# EAGLE schematic jardim (EAGLE 7.6.0)
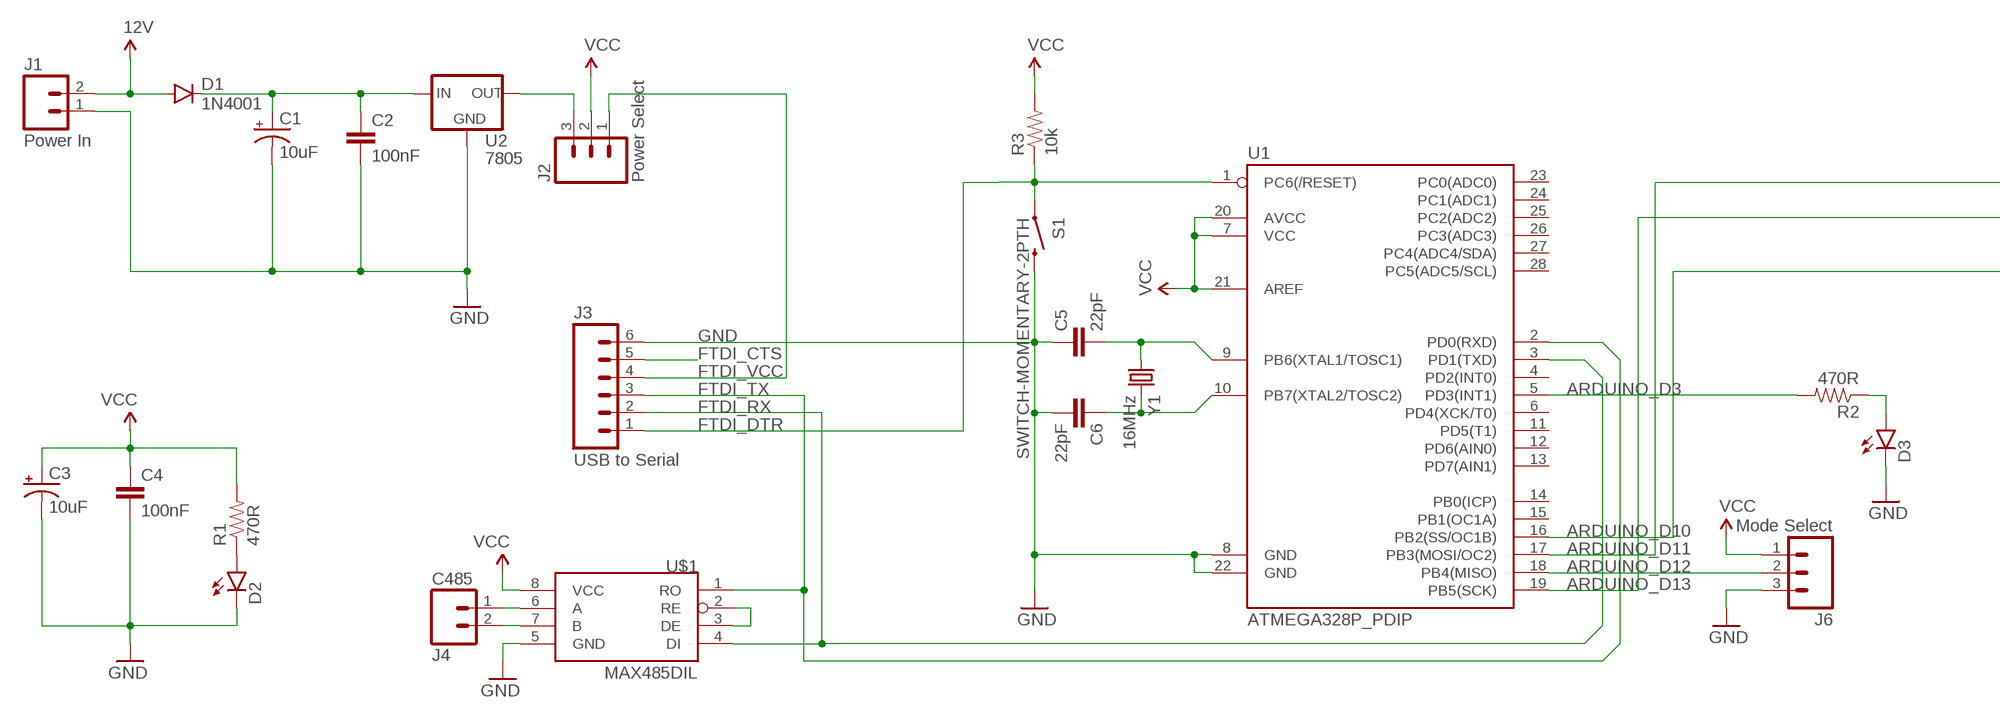
[diagram p0: schematic, sheet 1, part 1 of 2]
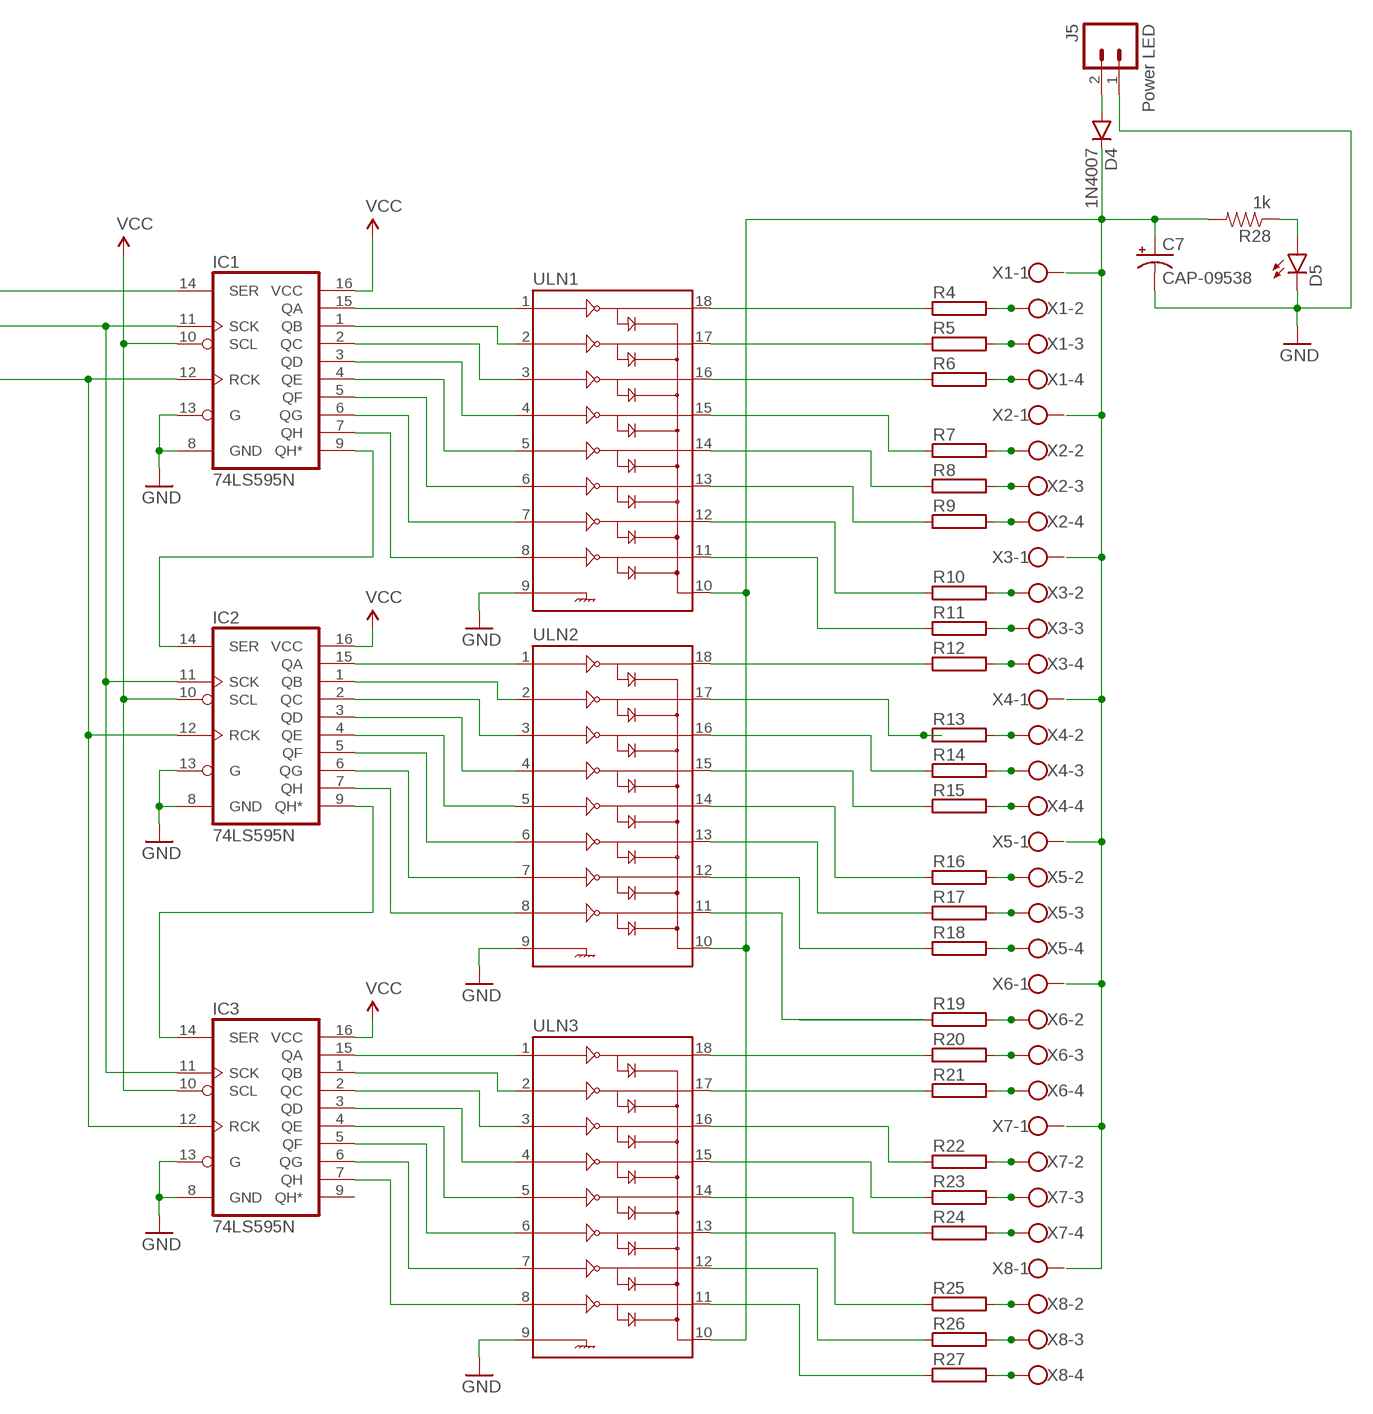
[diagram p1: schematic, sheet 1, part 2 of 2]

## Parts
C1  10uF  CAP_POLPTH2  [CPOL-RADIAL-10UF-25V]
C2  100nF  0.1UF-50V-20%(PTH)KIT-EZ  [CAP-PTH-SMALL-KIT]
C3  10uF  CAP_POLPTH2  [CPOL-RADIAL-10UF-25V]
C4  100nF  0.1UF-50V-20%(PTH)KIT-EZ  [CAP-PTH-SMALL-KIT]
C5  22pF  CAPKIT  [CAP-PTH-SMALL-KIT]
C6  22pF  CAPKIT  [CAP-PTH-SMALL-KIT]
C7  CAP-09538  1000UF-25V(PTH)  [CPOL-RADIAL-1000UF-25V]
D1  1N4001  DIODEKIT2  [DIODE-1N4001-KIT]
D2  LED3MM  [LED3MM]
D3  LED3MM  [LED3MM]
D4  1N4007  DIODEPTH  [DIODE-1N4001]
D5  LED3MM  [LED3MM]
IC1  74LS595N  [DIL16]
IC2  74LS595N  [DIL16]
IC3  74LS595N  [DIL16]
J1  Power In  M025MM  [SCREWTERMINAL-5MM-2]
J2  Power Select  M03PTH  [1X03]
J3  USB to Serial  M06SILK_FEMALE_PTH  [1X06]
J4  C485  M025MM  [SCREWTERMINAL-5MM-2]
J5  Power LED  M025MM  [SCREWTERMINAL-5MM-2]
J6  Mode Select  M03PTH  [1X03]
R1  470R  RESISTORPTH-1/4W  [AXIAL-0.4]
R2  470R  RESISTORPTH-1/4W  [AXIAL-0.4]
R3  10k  RESISTORPTH-1/4W  [AXIAL-0.4]
R4  RCA4080  [CA4080]
R5  RCA4080  [CA4080]
R6  RCA4080  [CA4080]
R7  RCA4080  [CA4080]
R8  RCA4080  [CA4080]
R9  RCA4080  [CA4080]
R10  RCA4080  [CA4080]
R11  RCA4080  [CA4080]
R12  RCA4080  [CA4080]
R13  RCA4080  [CA4080]
R14  RCA4080  [CA4080]
R15  RCA4080  [CA4080]
R16  RCA4080  [CA4080]
R17  RCA4080  [CA4080]
R18  RCA4080  [CA4080]
R19  RCA4080  [CA4080]
R20  RCA4080  [CA4080]
R21  RCA4080  [CA4080]
R22  RCA4080  [CA4080]
R23  RCA4080  [CA4080]
R24  RCA4080  [CA4080]
R25  RCA4080  [CA4080]
R26  RCA4080  [CA4080]
R27  RCA4080  [CA4080]
R28  1k  RESISTORPTH-1/4W  [AXIAL-0.4]
S1  SWITCH-MOMENTARY-2PTH  [TACTILE-PTH]
U1  ATMEGA328P_PDIP  [DIL28-3]
U2  7805  V_REG_78XX-TO-220  [TO-220-ALT]
U$1  MAX485DIL  [DIL08]
ULN1  ULN2803DIP  [DIL18]
ULN2  ULN2803DIP  [DIL18]
ULN3  ULN2803DIP  [DIL18]
X1  W237-4  [W237-4]
X2  W237-4  [W237-4]
X3  W237-4  [W237-4]
X4  W237-4  [W237-4]
X5  W237-4  [W237-4]
X6  W237-4  [W237-4]
X7  W237-4  [W237-4]
X8  W237-4  [W237-4]
Y1  16MHz  CRYSTALHC49US  [HC49US]

## Nets
12V: D1.A J1.2
ARDUINO_D3: R2.P$2 U1.5(PD3(INT1))
ARDUINO_D10: IC1.12(RCK) IC2.12(RCK) IC3.12(RCK) U1.16(PB2(SS/OC1B))
ARDUINO_D11: IC1.14(SER) U1.17(PB3(MOSI/OC2))
ARDUINO_D12: J6.2 U1.18(PB4(MISO))
ARDUINO_D13: IC1.11(SCK) IC2.11(SCK) IC3.11(SCK) U1.19(PB5(SCK))
FTDI_CTS: J3.5
FTDI_DTR: J3.1 R3.P$1 S1.1 U1.1(PC6(/RESET))
FTDI_RX: J3.2 U1.3(PD1(TXD)) U$1.4(DI)
FTDI_TX: J3.3 U1.2(PD0(RXD)) U$1.1(RO)
FTDI_VCC: J2.1 J3.4
GND: C1.2(-) C2.2 C3.2(-) C4.2 C5.1 C6.2 C7.- D2.K(C) D3.K(C) D5.K(C) IC1.8(GND) IC1.13(G) IC2.8(GND) IC2.13(G) IC3.8(GND) IC3.13(G) J1.1 J3.6 J5.1 J6.3 S1.3 U1.8(GND) U1.22(GND) U2.GND U$1.5(GND) ULN1.9 ULN2.9 ULN3.9
N$1: R4.1 ULN1.18
N$2: C1.1(+) C2.1 D1.C U2.IN
N$3: D2.A R1.P$1
N$4: C5.2 U1.9(PB6(XTAL1/TOSC1)) Y1.1
N$5: C6.1 U1.10(PB7(XTAL2/TOSC2)) Y1.2
N$6: D3.A R2.P$1
N$7: D4.A J5.2
N$9: R5.1 ULN1.17
N$10: U$1.2(RE) U$1.3(DE)
N$11: J4.1 U$1.6(A)
N$12: J4.2 U$1.7(B)
N$13: R6.1 ULN1.16
N$14: R7.2 X2.2
N$15: R7.1 ULN1.15
N$16: R8.1 ULN1.14
N$17: R9.1 ULN1.13
N$18: R4.2 X1.2
N$19: R5.2 X1.3
N$20: R6.2 X1.4
N$21: R10.1 ULN1.12
N$22: IC1.15(QA) ULN1.1
N$23: IC1.1(QB) ULN1.2
N$24: IC1.2(QC) ULN1.3
N$25: IC1.3(QD) ULN1.4
N$26: IC1.4(QE) ULN1.5
N$27: IC1.5(QF) ULN1.6
N$28: IC1.6(QG) ULN1.7
N$29: IC1.7(QH) ULN1.8
N$30: R8.2 X2.3
N$31: R9.2 X2.4
N$32: R11.1 ULN1.11
N$33: R12.1 ULN2.18
N$34: R13.1 ULN2.17
N$35: R14.1 ULN2.16
N$36: R10.2 X3.2
N$37: R11.2 X3.3
N$38: R12.2 X3.4
N$39: R15.1 ULN2.15
N$40: R16.1 ULN2.14
N$41: R17.1 ULN2.13
N$42: R18.1 ULN2.12
N$43: R13.2 X4.2
N$44: R14.2 X4.3
N$45: R15.2 X4.4
N$46: R19.1 ULN2.11
N$47: IC2.15(QA) ULN2.1
N$48: R20.1 ULN3.18
N$49: R21.1 ULN3.17
N$50: R16.2 X5.2
N$51: R17.2 X5.3
N$52: R18.2 X5.4
N$53: R22.1 ULN3.16
N$54: R23.1 ULN3.15
N$55: R24.1 ULN3.14
N$56: R25.1 ULN3.13
N$57: R19.2 X6.2
N$58: R20.2 X6.3
N$59: R21.2 X6.4
N$60: R26.1 ULN3.12
N$61: R27.1 ULN3.11
N$62: IC2.1(QB) ULN2.2
N$63: IC2.2(QC) ULN2.3
N$64: R22.2 X7.2
N$65: R23.2 X7.3
N$66: R24.2 X7.4
N$67: IC2.3(QD) ULN2.4
N$68: IC2.4(QE) ULN2.5
N$69: IC2.5(QF) ULN2.6
N$70: IC2.6(QG) ULN2.7
N$71: R25.2 X8.2
N$72: R26.2 X8.3
N$73: R27.2 X8.4
N$74: C7.+ D4.C R28.P$2 ULN1.10 ULN2.10 ULN3.10
N$75: IC2.7(QH) ULN2.8
N$76: IC3.15(QA) ULN3.1
N$77: IC3.1(QB) ULN3.2
N$78: IC3.2(QC) ULN3.3
N$79: IC3.3(QD) ULN3.4
N$80: IC3.4(QE) ULN3.5
N$81: IC3.5(QF) ULN3.6
N$82: IC3.6(QG) ULN3.7
N$83: IC3.7(QH) ULN3.8
N$84: D5.A R28.P$1
N$85: J2.3 U2.OUT
N$87: IC1.9(QH*) IC2.14(SER)
N$88: IC2.9(QH*) IC3.14(SER)
VCC: C3.1(+) C4.1 IC1.10(SCL) IC1.16(VCC) IC2.10(SCL) IC2.16(VCC) IC3.10(SCL) IC3.16(VCC) J2.2 J6.1 R1.P$2 R3.P$2 U1.7(VCC) U1.20(AVCC) U1.21(AREF) U$1.8(VCC)
Unconnected: IC3.9(QH*) U1.4(PD2(INT0)) U1.6(PD4(XCK/T0)) U1.11(PD5(T1)) U1.12(PD6(AIN0)) U1.13(PD7(AIN1)) U1.14(PB0(ICP)) U1.15(PB1(OC1A)) U1.23(PC0(ADC0)) U1.24(PC1(ADC1)) U1.25(PC2(ADC2)) U1.26(PC3(ADC3)) U1.27(PC4(ADC4/SDA)) U1.28(PC5(ADC5/SCL)) X1.1 X2.1 X3.1 X4.1 X5.1 X6.1 X7.1 X8.1

## Library data of the parts
C1 C3 = SparkFun-Capacitors:CAP_POL: Capacitor Polarized These are standard SMD and PTH capacitors. Normally 10uF, 47uF, and 100uF in electrolytic and tantalum varieties. Always verify the external diameter of the through hole cap, it varies with capacity, voltage, and manufacturer. The EIA devices should be standard.
C2 C4 = SparkFun-Capacitors:0.1UF-50V-20%(PTH): CAP-08370; PROD_ID: CAP-08370
C5 C6 = SparkFun-Capacitors:CAP: Capacitor Standard 0603 ceramic capacitor, and 0.1" leaded capacitor.
C7 = SparkFun-Capacitors:1000UF-25V(PTH): CAP-08070; PROD_ID: CAP-09538
D1 D4 = SparkFun-DiscreteSemi:DIODE: Diode These are standard reverse protection diodes and small signal diodes. SMA package can handle up to about 1A. SOD-323 can handle about 200mA. What the SOD-323 package when ordering, there are some mfgs out there that are 5-pin packages.
D2 D3 D5 = SparkFun-LED:LED: LEDs Standard schematic elements and footprints for 5mm, 3mm, 1206, and 0603 sized LEDs. 5mm - Spark Fun Electronics SKU : COM-00529 (and others); PROD_ID: DIO-08794
IC1-IC3 = SparkFun-DigitalIC:74*595: 8-bit SHIFT REGISTER, output latch
J1 J4 J5 = SparkFun-Connectors:M02: Standard 2-pin 0.1" header. Use with - straight break away headers ( PRT-00116) - right angle break away headers (PRT-00553) - swiss pins (PRT-00743) - machine pins (PRT-00117) - female headers (PRT-00115) Molex polarized connector foot print use with: PRT-08233 with associated crimp pins and housings. 2.54_SCREWTERM for use with PRT-10571. 3.5mm Screw Terminal footprints for PRT-08084 5mm Screw Terminal footprints for use with PRT-08432; STOREFRONT_ID: PRT-08432
J2 J6 = SparkFun-Connectors:M03: Header 3 Standard 3-pin 0.1" header. Use with straight break away headers (SKU : PRT-00116), right angle break away headers (PRT-00553), swiss pins (PRT-00743), machine pins (PRT-00117), and female headers (PRT-00115). Molex polarized connector foot print use with SKU : PRT-08232 with associated crimp pins and housings.
J3 = SparkFun-Connectors:M06: Header 6 Standard 6-pin 0.1" header. Use with straight break away headers (SKU : PRT-00116), right angle break away headers (PRT-00553), swiss pins (PRT-00743), machine pins (PRT-00117), and female headers (PRT-00115). Molex polarized connector foot print use with SKU : PRT-08094 with associated crimp pins and housings. NOTES ON THE VARIANTS LOCK and LOCK_LONGPADS... This footprint was designed to help hold the alignment of a through-hole component (i.e. 6-pin header) while soldering it into place. You may notice that each hole has been shifted either up or down by 0.005 of an inch from it's more standard position (which is a perfectly straight line). This slight alteration caused the pins (the squares in the middle) to touch the edges of the holes. Because they are alternating, it causes a "brace" to hold the component in place. 0.005 has proven to be the perfect amount of "off-center" position when using our standard breakaway headers. Although looks a little odd when you look at the bare footprint, once you have a header in there, the alteration is very hard to notice. Also,if you push a header all the way into place, it is covered up entirely on the bottom side. This idea of altering the position of holes to aid alignment will be further integrated into the Sparkfun Library for other footprints. It can help hold any component with 3 or more connection pins.; PROD_ID: CONN-08437
R1-R3 R28 = SparkFun-Resistors:RESISTOR: Resistor Basic schematic elements and footprints for 0603, 1206, and PTH resistors.
R4-R27 = resistor-power:R: Power Resitor; OC_FARNELL: unknown; OC_NEWARK: unknown
S1 = SparkFun-Electromechanical:SWITCH-MOMENTARY-2: Various NO switches- pushbuttons, reed, etc; PROD_ID: SWCH-08441
U1 = SparkFun-DigitalIC:ATMEGA328P_PDIP: uC used in the Arduino 32kb flash, 1k EEPROM, 2k SRAM This is the through-hole version of this chip.
U2 = SparkFun-PowerIC:V_REG_78XX: Voltage Regulator Standard 78xx regulator. IGO (Input Ground Output). Spark Fun Electronics SKU : COM-00107; PROD_ID: VREG-08450; SF_ID: COM-00107
U$1 = SparkFun-DigitalIC:MAX485: RS-485 transceiver
ULN1-ULN3 = SparkFun-PowerIC:ULN2803: Darlington Driver ULN2803 Darlington array. 500mA max per channel, 8-channel package. Spark Fun Electronics SKU : COM-00312
X1-X8 = con-wago-500:W237-4: WAGO SCREW CLAMP; OC_FARNELL: unknown; OC_NEWARK: unknown
Y1 = SparkFun-FreqCtrl:CRYSTAL: Various standard crystals. Proven footprints.